# Altium project ValentineMCU.PrjPCB
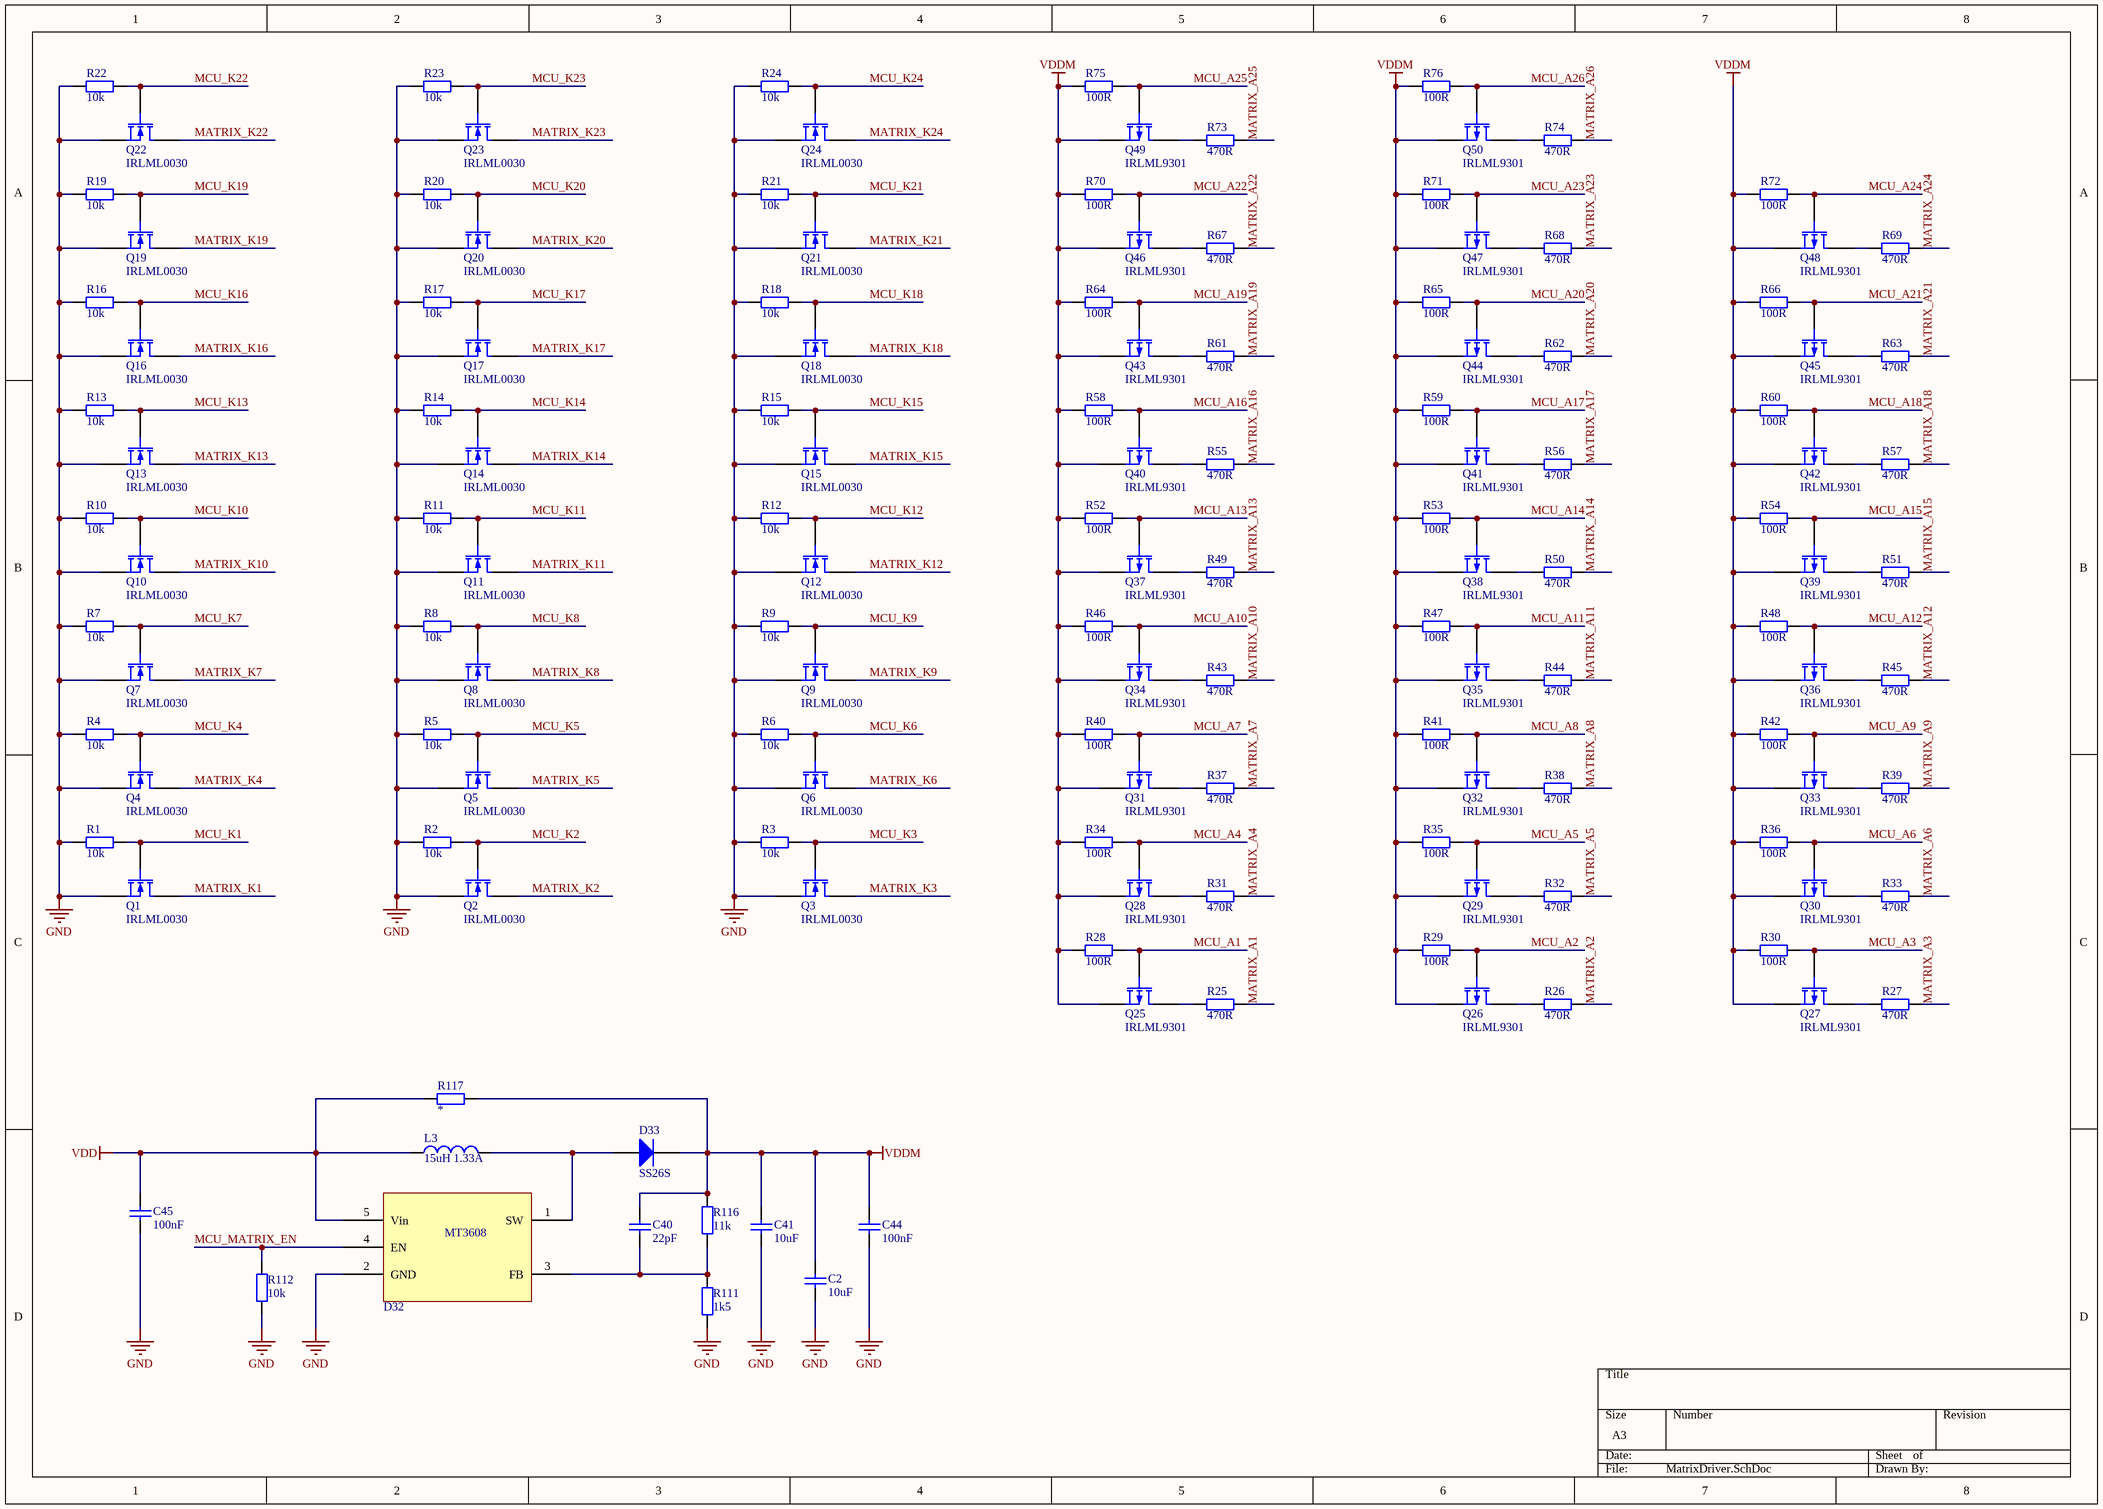
[diagram p0: MatrixDriver.SchDoc]
3 sheets, 262 parts. Net scope: global (net labels, ports and power ports of the same name join across sheets).
Board file: PCB2.PcbDoc
Sheets:
  MatrixDriver.SchDoc
  MCU.SchDoc
  MCULeds.SchDoc

## Sheet MatrixDriver.SchDoc
size A3

### Parts
C2  value 10uF  [c1206]  (hidden comment: Cap)
C40  value 22pF  [C0603]  (hidden comment: Cap)
C41  value 10uF  [c1206]  (hidden comment: Cap)
C44  value 100nF  [C0603]  (hidden comment: Cap)
C45  value 100nF  [C0603]  (hidden comment: Cap)
D32  MT3608  [SOT23-6_L]
D33  SS26S  [DO-214AB]
L3  value 15uH 1.33A  [DE0703]  (hidden comment: DE0703-15)
Q1  IRLML0030  [sot23]
Q2  IRLML0030  [sot23]
Q3  IRLML0030  [sot23]
Q4  IRLML0030  [sot23]
Q5  IRLML0030  [sot23]
Q6  IRLML0030  [sot23]
Q7  IRLML0030  [sot23]
Q8  IRLML0030  [sot23]
Q9  IRLML0030  [sot23]
Q10  IRLML0030  [sot23]
Q11  IRLML0030  [sot23]
Q12  IRLML0030  [sot23]
Q13  IRLML0030  [sot23]
Q14  IRLML0030  [sot23]
Q15  IRLML0030  [sot23]
Q16  IRLML0030  [sot23]
Q17  IRLML0030  [sot23]
Q18  IRLML0030  [sot23]
Q19  IRLML0030  [sot23]
Q20  IRLML0030  [sot23]
Q21  IRLML0030  [sot23]
Q22  IRLML0030  [sot23]
Q23  IRLML0030  [sot23]
Q24  IRLML0030  [sot23]
Q25  IRLML9301  [sot23]
Q26  IRLML9301  [sot23]
Q27  IRLML9301  [sot23]
Q28  IRLML9301  [sot23]
Q29  IRLML9301  [sot23]
Q30  IRLML9301  [sot23]
Q31  IRLML9301  [sot23]
Q32  IRLML9301  [sot23]
Q33  IRLML9301  [sot23]
Q34  IRLML9301  [sot23]
Q35  IRLML9301  [sot23]
Q36  IRLML9301  [sot23]
Q37  IRLML9301  [sot23]
Q38  IRLML9301  [sot23]
Q39  IRLML9301  [sot23]
Q40  IRLML9301  [sot23]
Q41  IRLML9301  [sot23]
Q42  IRLML9301  [sot23]
Q43  IRLML9301  [sot23]
Q44  IRLML9301  [sot23]
Q45  IRLML9301  [sot23]
Q46  IRLML9301  [sot23]
Q47  IRLML9301  [sot23]
Q48  IRLML9301  [sot23]
Q49  IRLML9301  [sot23]
Q50  IRLML9301  [sot23]
R1  value 10k  [r0603]  (hidden comment: Resistor)
R2  value 10k  [r0603]  (hidden comment: Resistor)
R3  value 10k  [r0603]  (hidden comment: Resistor)
R4  value 10k  [r0603]  (hidden comment: Resistor)
R5  value 10k  [r0603]  (hidden comment: Resistor)
R6  value 10k  [r0603]  (hidden comment: Resistor)
R7  value 10k  [r0603]  (hidden comment: Resistor)
R8  value 10k  [r0603]  (hidden comment: Resistor)
R9  value 10k  [r0603]  (hidden comment: Resistor)
R10  value 10k  [r0603]  (hidden comment: Resistor)
R11  value 10k  [r0603]  (hidden comment: Resistor)
R12  value 10k  [r0603]  (hidden comment: Resistor)
R13  value 10k  [r0603]  (hidden comment: Resistor)
R14  value 10k  [r0603]  (hidden comment: Resistor)
R15  value 10k  [r0603]  (hidden comment: Resistor)
R16  value 10k  [r0603]  (hidden comment: Resistor)
R17  value 10k  [r0603]  (hidden comment: Resistor)
R18  value 10k  [r0603]  (hidden comment: Resistor)
R19  value 10k  [r0603]  (hidden comment: Resistor)
R20  value 10k  [r0603]  (hidden comment: Resistor)
R21  value 10k  [r0603]  (hidden comment: Resistor)
R22  value 10k  [r0603]  (hidden comment: Resistor)
R23  value 10k  [r0603]  (hidden comment: Resistor)
R24  value 10k  [r0603]  (hidden comment: Resistor)
R25  value 470R  [r0603]  (hidden comment: Resistor)
R26  value 470R  [r0603]  (hidden comment: Resistor)
R27  value 470R  [r0603]  (hidden comment: Resistor)
R28  value 100R  [r0603]  (hidden comment: Resistor)
R29  value 100R  [r0603]  (hidden comment: Resistor)
R30  value 100R  [r0603]  (hidden comment: Resistor)
R31  value 470R  [r0603]  (hidden comment: Resistor)
R32  value 470R  [r0603]  (hidden comment: Resistor)
R33  value 470R  [r0603]  (hidden comment: Resistor)
R34  value 100R  [r0603]  (hidden comment: Resistor)
R35  value 100R  [r0603]  (hidden comment: Resistor)
R36  value 100R  [r0603]  (hidden comment: Resistor)
R37  value 470R  [r0603]  (hidden comment: Resistor)
R38  value 470R  [r0603]  (hidden comment: Resistor)
R39  value 470R  [r0603]  (hidden comment: Resistor)
R40  value 100R  [r0603]  (hidden comment: Resistor)
R41  value 100R  [r0603]  (hidden comment: Resistor)
R42  value 100R  [r0603]  (hidden comment: Resistor)
R43  value 470R  [r0603]  (hidden comment: Resistor)
R44  value 470R  [r0603]  (hidden comment: Resistor)
R45  value 470R  [r0603]  (hidden comment: Resistor)
R46  value 100R  [r0603]  (hidden comment: Resistor)
R47  value 100R  [r0603]  (hidden comment: Resistor)
R48  value 100R  [r0603]  (hidden comment: Resistor)
R49  value 470R  [r0603]  (hidden comment: Resistor)
R50  value 470R  [r0603]  (hidden comment: Resistor)
R51  value 470R  [r0603]  (hidden comment: Resistor)
R52  value 100R  [r0603]  (hidden comment: Resistor)
R53  value 100R  [r0603]  (hidden comment: Resistor)
R54  value 100R  [r0603]  (hidden comment: Resistor)
R55  value 470R  [r0603]  (hidden comment: Resistor)
R56  value 470R  [r0603]  (hidden comment: Resistor)
R57  value 470R  [r0603]  (hidden comment: Resistor)
R58  value 100R  [r0603]  (hidden comment: Resistor)
R59  value 100R  [r0603]  (hidden comment: Resistor)
R60  value 100R  [r0603]  (hidden comment: Resistor)
R61  value 470R  [r0603]  (hidden comment: Resistor)
R62  value 470R  [r0603]  (hidden comment: Resistor)
R63  value 470R  [r0603]  (hidden comment: Resistor)
R64  value 100R  [r0603]  (hidden comment: Resistor)
R65  value 100R  [r0603]  (hidden comment: Resistor)
R66  value 100R  [r0603]  (hidden comment: Resistor)
R67  value 470R  [r0603]  (hidden comment: Resistor)
R68  value 470R  [r0603]  (hidden comment: Resistor)
R69  value 470R  [r0603]  (hidden comment: Resistor)
R70  value 100R  [r0603]  (hidden comment: Resistor)
R71  value 100R  [r0603]  (hidden comment: Resistor)
R72  value 100R  [r0603]  (hidden comment: Resistor)
R73  value 470R  [r0603]  (hidden comment: Resistor)
R74  value 470R  [r0603]  (hidden comment: Resistor)
R75  value 100R  [r0603]  (hidden comment: Resistor)
R76  value 100R  [r0603]  (hidden comment: Resistor)
R111  value 1k5  [r0603]  (hidden comment: Resistor)
R112  value 10k  [r0603]  (hidden comment: Resistor)
R116  value 11k  [r0603]  (hidden comment: Resistor)
R117  Resistor  [n0603]  (value not drawn)

### Nets
GND: C2.1 C41.1 C44.1 C45.1 D32.2(GND) Q1.2(S) Q2.2(S) Q3.2(S) Q4.2(S) Q5.2(S) Q6.2(S) Q7.2(S) Q8.2(S) Q9.2(S) Q10.2(S) Q11.2(S) Q12.2(S) Q13.2(S) Q14.2(S) Q15.2(S) Q16.2(S) Q17.2(S) Q18.2(S) Q19.2(S) Q20.2(S) Q21.2(S) Q22.2(S) Q23.2(S) Q24.2(S) R1.1 R2.1 R3.1 R4.1 R5.1 R6.1 R7.1 R8.1 R9.1 R10.1 R11.1 R12.1 R13.1 R14.1 R15.1 R16.1 R17.1 R18.1 R19.1 R20.1 R21.1 R22.1 R23.1 R24.1 R111.1 R112.1
VDD: C45.2 D32.5(Vin) L3.1 R117.2
VDDM: C2.2 C40.2 C41.2 C44.2 D33.2(K) Q25.2(S) Q26.2(S) Q27.2(S) Q28.2(S) Q29.2(S) Q30.2(S) Q31.2(S) Q32.2(S) Q33.2(S) Q34.2(S) Q35.2(S) Q36.2(S) Q37.2(S) Q38.2(S) Q39.2(S) Q40.2(S) Q41.2(S) Q42.2(S) Q43.2(S) Q44.2(S) Q45.2(S) Q46.2(S) Q47.2(S) Q48.2(S) Q49.2(S) Q50.2(S) R28.1 R29.1 R30.1 R34.1 R35.1 R36.1 R40.1 R41.1 R42.1 R46.1 R47.1 R48.1 R52.1 R53.1 R54.1 R58.1 R59.1 R60.1 R64.1 R65.1 R66.1 R70.1 R71.1 R72.1 R75.1 R76.1 R116.2 R117.1
MATRIX_A1: R25.2
MATRIX_A2: R26.2
MATRIX_A3: R27.2
MATRIX_A4: R31.2
MATRIX_A5: R32.2
MATRIX_A6: R33.2
MATRIX_A7: R37.2
MATRIX_A8: R38.2
MATRIX_A9: R39.2
MATRIX_A10: R43.2
MATRIX_A11: R44.2
MATRIX_A12: R45.2
MATRIX_A13: R49.2
MATRIX_A14: R50.2
MATRIX_A15: R51.2
MATRIX_A16: R55.2
MATRIX_A17: R56.2
MATRIX_A18: R57.2
MATRIX_A19: R61.2
MATRIX_A20: R62.2
MATRIX_A21: R63.2
MATRIX_A22: R67.2
MATRIX_A23: R68.2
MATRIX_A24: R69.2
MATRIX_A25: R73.2
MATRIX_A26: R74.2
MATRIX_K1: Q1.3(D)
MATRIX_K2: Q2.3(D)
MATRIX_K3: Q3.3(D)
MATRIX_K4: Q4.3(D)
MATRIX_K5: Q5.3(D)
MATRIX_K6: Q6.3(D)
MATRIX_K7: Q7.3(D)
MATRIX_K8: Q8.3(D)
MATRIX_K9: Q9.3(D)
MATRIX_K10: Q10.3(D)
MATRIX_K11: Q11.3(D)
MATRIX_K12: Q12.3(D)
MATRIX_K13: Q13.3(D)
MATRIX_K14: Q14.3(D)
MATRIX_K15: Q15.3(D)
MATRIX_K16: Q16.3(D)
MATRIX_K17: Q17.3(D)
MATRIX_K18: Q18.3(D)
MATRIX_K19: Q19.3(D)
MATRIX_K20: Q20.3(D)
MATRIX_K21: Q21.3(D)
MATRIX_K22: Q22.3(D)
MATRIX_K23: Q23.3(D)
MATRIX_K24: Q24.3(D)
MCU_A1: Q25.1(G) R28.2
MCU_A2: Q26.1(G) R29.2
MCU_A3: Q27.1(G) R30.2
MCU_A4: Q28.1(G) R34.2
MCU_A5: Q29.1(G) R35.2
MCU_A6: Q30.1(G) R36.2
MCU_A7: Q31.1(G) R40.2
MCU_A8: Q32.1(G) R41.2
MCU_A9: Q33.1(G) R42.2
MCU_A10: Q34.1(G) R46.2
MCU_A11: Q35.1(G) R47.2
MCU_A12: Q36.1(G) R48.2
MCU_A13: Q37.1(G) R52.2
MCU_A14: Q38.1(G) R53.2
MCU_A15: Q39.1(G) R54.2
MCU_A16: Q40.1(G) R58.2
MCU_A17: Q41.1(G) R59.2
MCU_A18: Q42.1(G) R60.2
MCU_A19: Q43.1(G) R64.2
MCU_A20: Q44.1(G) R65.2
MCU_A21: Q45.1(G) R66.2
MCU_A22: Q46.1(G) R70.2
MCU_A23: Q47.1(G) R71.2
MCU_A24: Q48.1(G) R72.2
MCU_A25: Q49.1(G) R75.2
MCU_A26: Q50.1(G) R76.2
MCU_K1: Q1.1(G) R1.2
MCU_K2: Q2.1(G) R2.2
MCU_K3: Q3.1(G) R3.2
MCU_K4: Q4.1(G) R4.2
MCU_K5: Q5.1(G) R5.2
MCU_K6: Q6.1(G) R6.2
MCU_K7: Q7.1(G) R7.2
MCU_K8: Q8.1(G) R8.2
MCU_K9: Q9.1(G) R9.2
MCU_K10: Q10.1(G) R10.2
MCU_K11: Q11.1(G) R11.2
MCU_K12: Q12.1(G) R12.2
MCU_K13: Q13.1(G) R13.2
MCU_K14: Q14.1(G) R14.2
MCU_K15: Q15.1(G) R15.2
MCU_K16: Q16.1(G) R16.2
MCU_K17: Q17.1(G) R17.2
MCU_K18: Q18.1(G) R18.2
MCU_K19: Q19.1(G) R19.2
MCU_K20: Q20.1(G) R20.2
MCU_K21: Q21.1(G) R21.2
MCU_K22: Q22.1(G) R22.2
MCU_K23: Q23.1(G) R23.2
MCU_K24: Q24.1(G) R24.2
MCU_MATRIX_EN: D32.4(EN) R112.2
NetC40_1: C40.1 D32.3(FB) R111.2 R116.1
NetD32_1: D32.1(SW) D33.1(A) L3.2
NetQ25_3: Q25.3(D) R25.1
NetQ26_3: Q26.3(D) R26.1
NetQ27_3: Q27.3(D) R27.1
NetQ28_3: Q28.3(D) R31.1
NetQ29_3: Q29.3(D) R32.1
NetQ30_3: Q30.3(D) R33.1
NetQ31_3: Q31.3(D) R37.1
NetQ32_3: Q32.3(D) R38.1
NetQ33_3: Q33.3(D) R39.1
NetQ34_3: Q34.3(D) R43.1
NetQ35_3: Q35.3(D) R44.1
NetQ36_3: Q36.3(D) R45.1
NetQ37_3: Q37.3(D) R49.1
NetQ38_3: Q38.3(D) R50.1
NetQ39_3: Q39.3(D) R51.1
NetQ40_3: Q40.3(D) R55.1
NetQ41_3: Q41.3(D) R56.1
NetQ42_3: Q42.3(D) R57.1
NetQ43_3: Q43.3(D) R61.1
NetQ44_3: Q44.3(D) R62.1
NetQ45_3: Q45.3(D) R63.1
NetQ46_3: Q46.3(D) R67.1
NetQ47_3: Q47.3(D) R68.1
NetQ48_3: Q48.3(D) R69.1
NetQ49_3: Q49.3(D) R73.1
NetQ50_3: Q50.3(D) R74.1

### Library data of the parts
C2 C40 C41 C44 C45 = Cap: Capacitor; Published: 8-Jun-2000; LatestRevisionDate: 17-Jul-2002; LatestRevisionNote: Re-released for DXP Platform.; PackageReference: RAD-0.3; Publisher: Altium Limited; PackageDescription: Radial Cap, Thru-Hole; 2 Leads; 0.3 in Pin Spacing
D33 = Diode: Default Diode; Published: 8-Jun-2000; LatestRevisionDate: 17-Jul-2002; LatestRevisionNote: Re-released for DXP Platform.; PackageVersion: Sep-1996; PackageReference: SMC; Publisher: Altium Limited; PackageDescription: DO-214-AB/SMC; 2 C-Bend Leads; Body 7.9 x 5.9 mm, inc. leads (LxW); Code_JEDEC: DO-214-AB
L3 = Inductor: Code_IEC: 1005; Published: 8-Jun-2000; LatestRevisionDate: 29-May-2009; LatestRevisionNote: IPC-7351 Footprint Added.; PackageReference: 0402-A; Publisher: Altium Limited; PackageDescription: Chip Inductor; Code_JEITA: 0402
Q1-Q24 = MOSFET-N: N-Channel MOSFET; Published: 8-Jun-2000; LatestRevisionDate: 17-Jul-2002; LatestRevisionNote: Re-released for DXP Platform.; PackageVersion: 1995/1996; PackageReference: E3; Publisher: Altium Limited; PackageDescription: TO, Flat Index; 3 In-Line, Axial Leads; Body Dia. 4.6mm; Lead Dia. 0.5 mm (max)
Q25-Q50 = MOSFET-P: P-Channel MOSFET; Published: 8-Jun-2000; LatestRevisionDate: 17-Jul-2002; LatestRevisionNote: Re-released for DXP Platform.; PackageVersion: 1995/1996; PackageReference: E3; Publisher: Altium Limited; PackageDescription: TO, Flat Index; 3 In-Line, Axial Leads; Body Dia. 4.6mm; Lead Dia. 0.5 mm (max)
R1-R76 R111 R112 R116 R117 = Resistor: Published: 8-Jun-2000; LatestRevisionDate: 17-Jul-2002; LatestRevisionNote: Re-released for DXP Platform.; PackageReference: AXIAL-0.4; Publisher: Altium Limited; PackageDescription: Axial Device, Thru-Hole; 2 Leads; 0.4 in Pin Spacing
  R117: Value: *

## Sheet MCU.SchDoc
size A3
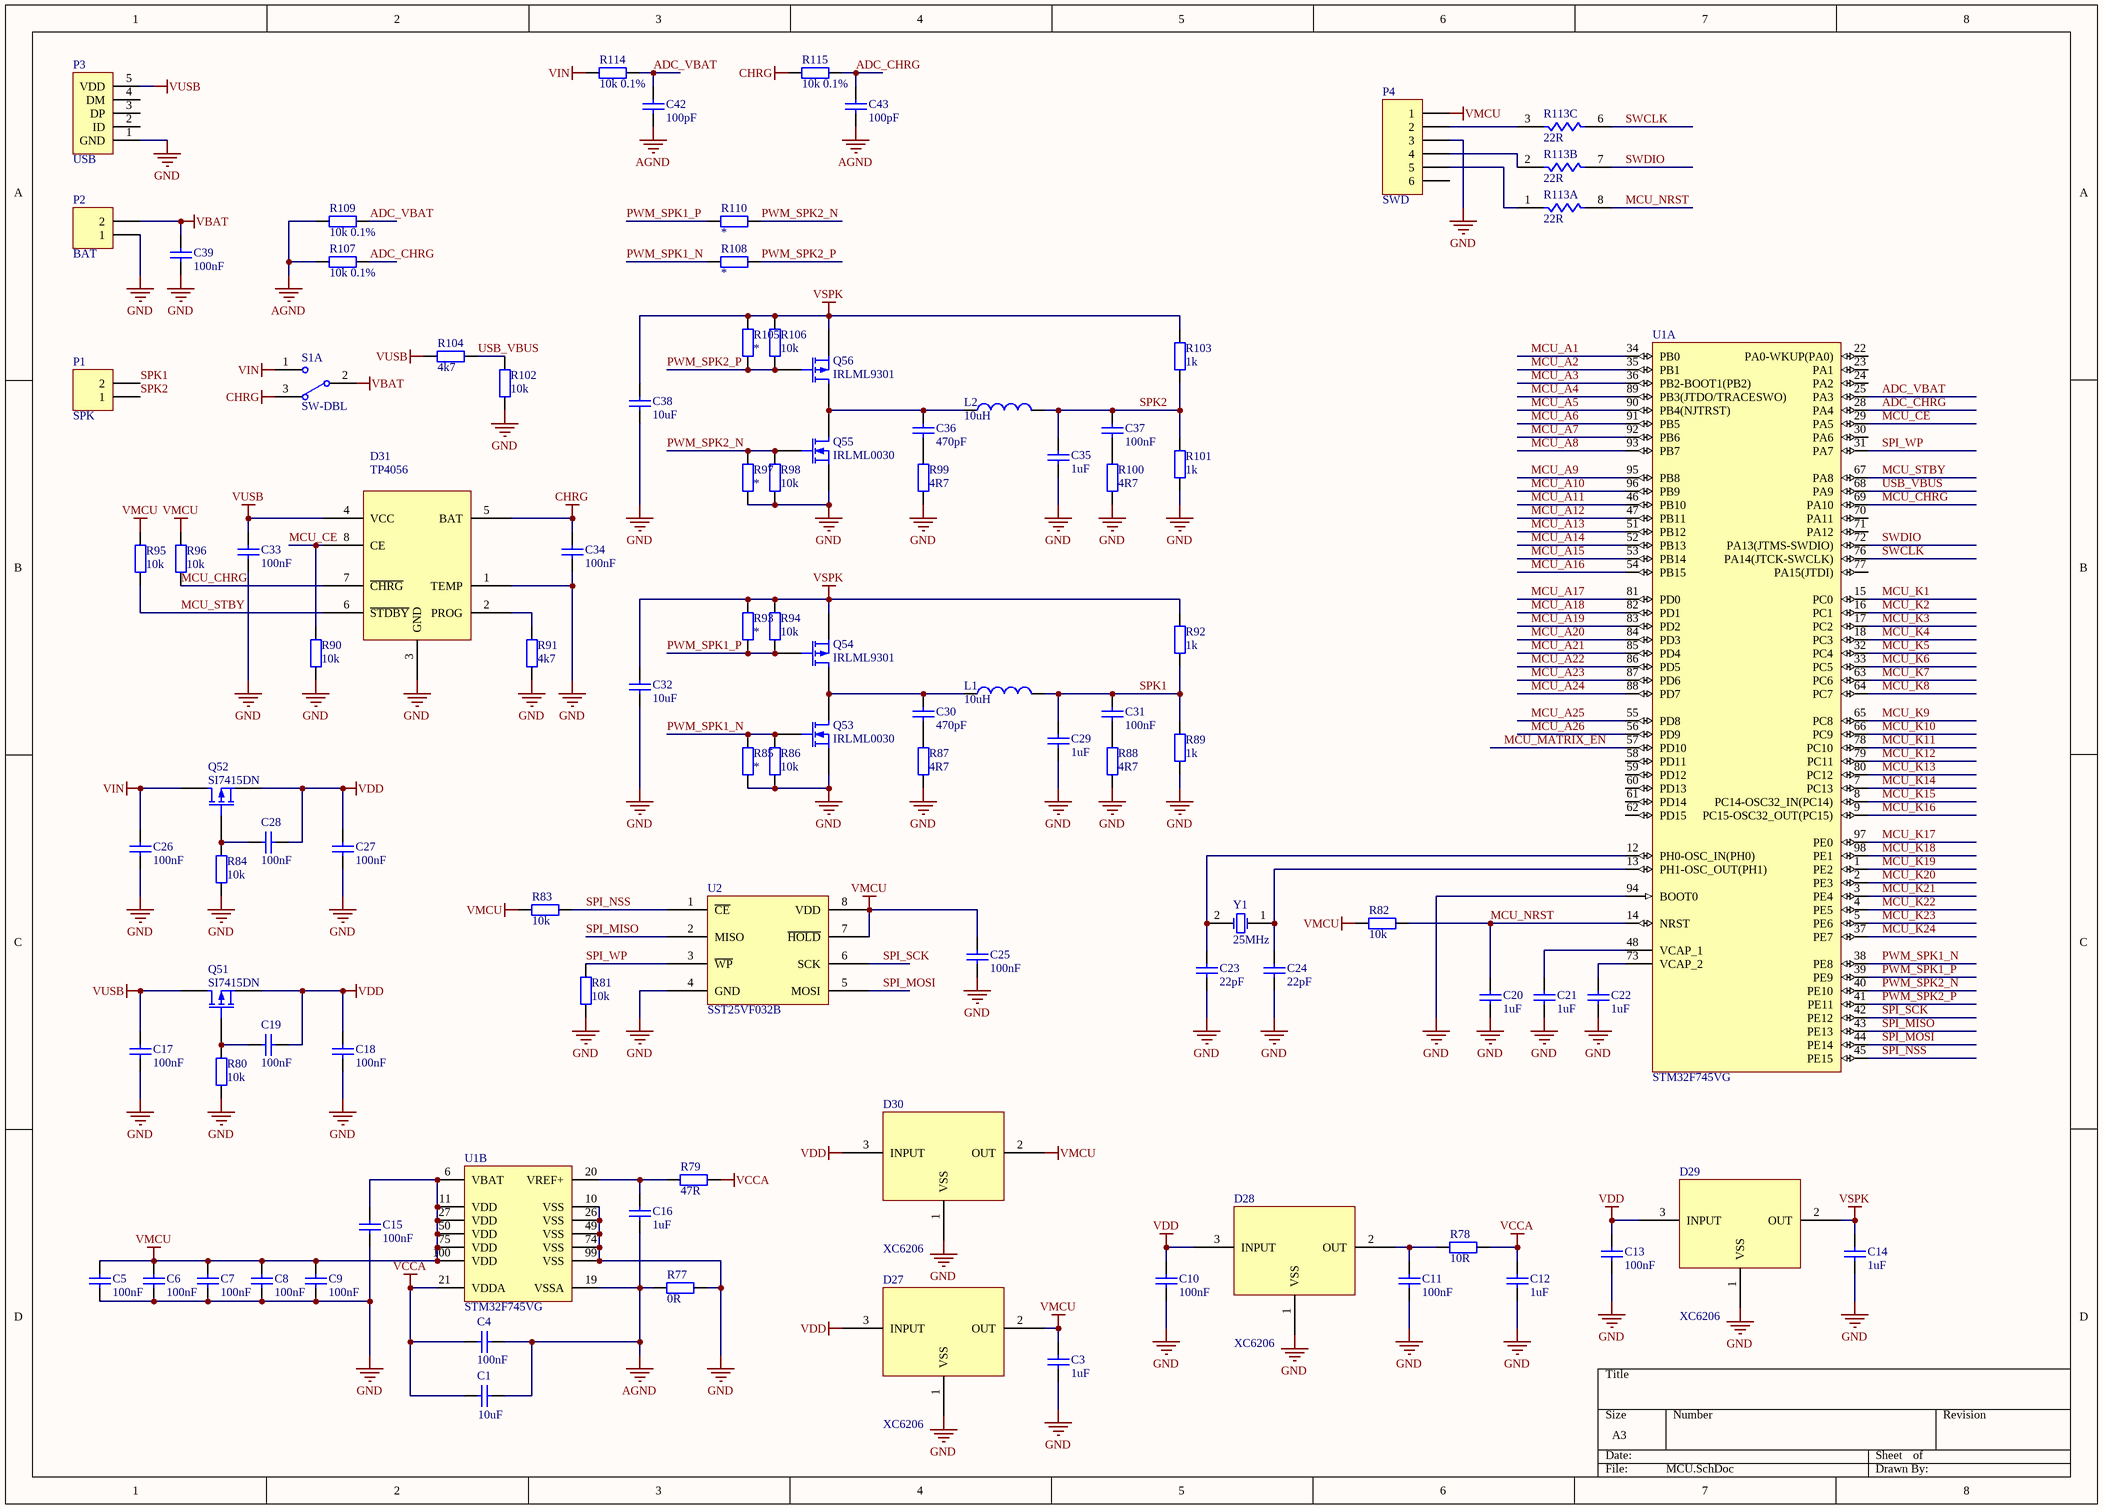
[diagram p1: MCU.SchDoc]

### Parts
C1  value 10uF  [c1206]  (hidden comment: Cap)
C3  value 1uF  [C0603]  (hidden comment: Cap)
C4  value 100nF  [C0603]  (hidden comment: Cap)
C5  value 100nF  [C0603]  (hidden comment: Cap)
C6  value 100nF  [C0603]  (hidden comment: Cap)
C7  value 100nF  [C0603]  (hidden comment: Cap)
C8  value 100nF  [C0603]  (hidden comment: Cap)
C9  value 100nF  [C0603]  (hidden comment: Cap)
C10  value 100nF  [C0603]  (hidden comment: Cap)
C11  value 100nF  [C0603]  (hidden comment: Cap)
C12  value 1uF  [C0603]  (hidden comment: Cap)
C13  value 100nF  [C0603]  (hidden comment: Cap)
C14  value 1uF  [C0603]  (hidden comment: Cap)
C15  value 100nF  [C0603]  (hidden comment: Cap)
C16  value 1uF  [C0603]  (hidden comment: Cap)
C17  value 100nF  [C0603]  (hidden comment: Cap)
C18  value 100nF  [C0603]  (hidden comment: Cap)
C19  value 100nF  [C0603]  (hidden comment: Cap)
C20  value 1uF  [C0603]  (hidden comment: Cap)
C21  value 1uF  [C0603]  (hidden comment: Cap)
C22  value 1uF  [C0603]  (hidden comment: Cap)
C23  value 22pF  [c0603]
C24  value 22pF  [c0603]
C25  value 100nF  [C0603]  (hidden comment: Cap)
C26  value 100nF  [C0603]  (hidden comment: Cap)
C27  value 100nF  [C0603]  (hidden comment: Cap)
C28  value 100nF  [C0603]  (hidden comment: Cap)
C29  value 1uF  [C0603]  (hidden comment: Cap)
C30  value 470pF  [C0603]  (hidden comment: Cap)
C31  value 100nF  [C0603]  (hidden comment: Cap)
C32  value 10uF  [c1206]  (hidden comment: Cap)
C33  value 100nF  [C0603]  (hidden comment: Cap)
C34  value 100nF  [C0603]  (hidden comment: Cap)
C35  value 1uF  [C0603]  (hidden comment: Cap)
C36  value 470pF  [C0603]  (hidden comment: Cap)
C37  value 100nF  [C0603]  (hidden comment: Cap)
C38  value 10uF  [c1206]  (hidden comment: Cap)
C39  value 100nF  [C0603]  (hidden comment: Cap)
C42  value 100pF  [C0603]  (hidden comment: Cap)
C43  value 100pF  [C0603]  (hidden comment: Cap)
D27  XC6206  [sot23]
D28  XC6206  [sot23]
D29  XC6206  [sot23]
D30  XC6206  [sot23]
D31  TP4056  [SO8_WPAD]
L1  value 10uH  [CD32_Inductor]
L2  value 10uH  [CD32_Inductor]
P1  SPK  [HDR1X2]
P2  BAT  [HDR1X2]
P3  USB  [MICRO_USB]
P4  SWD  [HDR1X6]
Q51  SI7415DN  [PowerPAK1212-8]
Q52  SI7415DN  [PowerPAK1212-8]
Q53  IRLML0030  [sot23]
Q54  IRLML9301  [sot23]
Q55  IRLML0030  [sot23]
Q56  IRLML9301  [sot23]
R77  value 0R  [r0603]  (hidden comment: Resistor)
R78  value 10R  [r0603]  (hidden comment: Resistor)
R79  value 47R  [r0603]  (hidden comment: Resistor)
R80  value 10k  [r0603]  (hidden comment: Resistor)
R81  value 10k  [r0603]  (hidden comment: Resistor)
R82  value 10k  [r0603]  (hidden comment: Resistor)
R83  value 10k  [r0603]  (hidden comment: Resistor)
R84  value 10k  [r0603]  (hidden comment: Resistor)
R85  Resistor  [n0603]  (value not drawn)
R86  value 10k  [r0603]  (hidden comment: Resistor)
R87  value 4R7  [r0603]  (hidden comment: Resistor)
R88  value 4R7  [r0603]  (hidden comment: Resistor)
R89  value 1k  [r0603]  (hidden comment: Resistor)
R90  value 10k  [r0603]  (hidden comment: Resistor)
R91  value 4k7  [r0603]  (hidden comment: Resistor)
R92  value 1k  [r0603]  (hidden comment: Resistor)
R93  Resistor  [n0603]  (value not drawn)
R94  value 10k  [r0603]  (hidden comment: Resistor)
R95  value 10k  [r0603]  (hidden comment: Resistor)
R96  value 10k  [r0603]  (hidden comment: Resistor)
R97  Resistor  [n0603]  (value not drawn)
R98  value 10k  [r0603]  (hidden comment: Resistor)
R99  value 4R7  [r0603]  (hidden comment: Resistor)
R100  value 4R7  [r0603]  (hidden comment: Resistor)
R101  value 1k  [r0603]  (hidden comment: Resistor)
R102  value 10k  [r0603]  (hidden comment: Resistor)
R103  value 1k  [r0603]  (hidden comment: Resistor)
R104  value 4k7  [r0603]  (hidden comment: Resistor)
R105  Resistor  [n0603]  (value not drawn)
R106  value 10k  [r0603]  (hidden comment: Resistor)
R107  value 10k 0.1%  [r0603]  (hidden comment: Resistor)
R108  Resistor  [n0603]  (value not drawn)
R109  value 10k 0.1%  [r0603]  (hidden comment: Resistor)
R110  Resistor  [n0603]  (value not drawn)
R113  value 22R  [R1206_PACK]  (hidden comment: Res Pack 1206)  (parts A,B,C of 4)
R114  value 10k 0.1%  [r0603]  (hidden comment: Resistor)
R115  value 10k 0.1%  [r0603]  (hidden comment: Resistor)
S1  SW-DBL  [SK-22D07VG5]  (part A of 2)
U1  STM32F745VG  [lqfp100_m]  (parts A,B of 2)
U2  SST25VF032B  [SO8_25EE]
Y1  25MHz  [KX-7]

### Nets
AGND: C1.2 C4.2 C16.1 C42.1 C43.1 R77.1 R107.2 R109.2 U1.19(VSSA)
CHRG: C34.2 D31.5(BAT) R115.2 S1.3
GND: C3.1 C5.1 C6.1 C7.1 C8.1 C9.1 C10.1 C11.1 C12.1 C13.1 C14.1 C15.1 C17.1 C18.1 C20.1 C21.1 C22.1 C23.2 C24.2 C25.1 C26.1 C27.1 C29.1 C32.1 C33.1 C34.1 C35.1 C38.1 C39.1 D27.1(VSS) D28.1(VSS) D29.1(VSS) D30.1(VSS) D31.1(TEMP) D31.3(GND) P2.1 P3.1(GND) P4.3 Q53.2(S) Q55.2(S) R77.2 R80.1 R81.1 R84.1 R85.1 R86.1 R87.1 R88.1 R89.1 R90.1 R91.1 R97.1 R98.1 R99.1 R100.1 R101.1 R102.2 U1.10(VSS) U1.26(VSS) U1.49(VSS) U1.74(VSS) U1.94(BOOT0) U1.99(VSS) U2.4(GND)
VBAT: C39.2 P2.2 S1.2
VCCA: C1.1 C4.1 C12.2 R78.2 R79.2 U1.21(VDDA)
VDD: C10.2 C13.2 C18.2 C19.1 C27.2 C28.1 D27.3(INPUT) D28.3(INPUT) D29.3(INPUT) D30.3(INPUT) Q51.2(S) Q52.2(S)
VIN: C26.2 Q52.3(D) R114.2 S1.1
VMCU: C3.2 C5.2 C6.2 C7.2 C8.2 C9.2 C15.2 C25.2 D27.2(OUT) D30.2(OUT) P4.1 R82.1 R83.1 R95.2 R96.2 U1.6(VBAT) U1.11(VDD) U1.27(VDD) U1.50(VDD) U1.75(VDD) U1.100(VDD) U2.7(~{HOLD}) U2.8(VDD)
VSPK: C14.2 C32.2 C38.2 D29.2(OUT) Q54.2(S) Q56.2(S) R92.2 R93.2 R94.2 R103.2 R105.2 R106.2
VUSB: C17.2 C33.2 D31.4(VCC) P3.5(VDD) Q51.3(D) R104.2
ADC_CHRG: C43.2 R107.1 R115.1 U1.28(PA4)
ADC_VBAT: C42.2 R109.1 R114.1 U1.25(PA3)
MCU_A1: U1.34(PB0)
MCU_A2: U1.35(PB1)
MCU_A3: U1.36(PB2-BOOT1(PB2))
MCU_A4: U1.89(PB3(JTDO/TRACESWO))
MCU_A5: U1.90(PB4(NJTRST))
MCU_A6: U1.91(PB5)
MCU_A7: U1.92(PB6)
MCU_A8: U1.93(PB7)
MCU_A9: U1.95(PB8)
MCU_A10: U1.96(PB9)
MCU_A11: U1.46(PB10)
MCU_A12: U1.47(PB11)
MCU_A13: U1.51(PB12)
MCU_A14: U1.52(PB13)
MCU_A15: U1.53(PB14)
MCU_A16: U1.54(PB15)
MCU_A17: U1.81(PD0)
MCU_A18: U1.82(PD1)
MCU_A19: U1.83(PD2)
MCU_A20: U1.84(PD3)
MCU_A21: U1.85(PD4)
MCU_A22: U1.86(PD5)
MCU_A23: U1.87(PD6)
MCU_A24: U1.88(PD7)
MCU_A25: U1.55(PD8)
MCU_A26: U1.56(PD9)
MCU_CE: D31.8(CE) R90.2 U1.29(PA5)
MCU_CHRG: D31.7(~{CHRG}) R96.1 U1.69(PA10)
MCU_K1: U1.15(PC0)
MCU_K2: U1.16(PC1)
MCU_K3: U1.17(PC2)
MCU_K4: U1.18(PC3)
MCU_K5: U1.32(PC4)
MCU_K6: U1.33(PC5)
MCU_K7: U1.63(PC6)
MCU_K8: U1.64(PC7)
MCU_K9: U1.65(PC8)
MCU_K10: U1.66(PC9)
MCU_K11: U1.78(PC10)
MCU_K12: U1.79(PC11)
MCU_K13: U1.80(PC12)
MCU_K14: U1.7(PC13)
MCU_K15: U1.8(PC14-OSC32_IN(PC14))
MCU_K16: U1.9(PC15-OSC32_OUT(PC15))
MCU_K17: U1.97(PE0)
MCU_K18: U1.98(PE1)
MCU_K19: U1.1(PE2)
MCU_K20: U1.2(PE3)
MCU_K21: U1.3(PE4)
MCU_K22: U1.4(PE5)
MCU_K23: U1.5(PE6)
MCU_K24: U1.37(PE7)
MCU_MATRIX_EN: U1.57(PD10)
MCU_NRST: C20.2 R82.2 R113.8 U1.14(NRST)
MCU_STBY: D31.6(~{STDBY}) R95.1 U1.67(PA8)
PWM_SPK1_N: Q53.1(G) R85.2 R86.2 R108.2 U1.38(PE8)
PWM_SPK1_P: Q54.1(G) R93.1 R94.1 R110.2 U1.39(PE9)
PWM_SPK2_N: Q55.1(G) R97.2 R98.2 R110.1 U1.40(PE10)
PWM_SPK2_P: Q56.1(G) R105.1 R106.1 R108.1 U1.41(PE11)
SPI_MISO: U1.43(PE13) U2.2(MISO)
SPI_MOSI: U1.44(PE14) U2.5(MOSI)
SPI_NSS: R83.2 U1.45(PE15) U2.1(~{CE})
SPI_SCK: U1.42(PE12) U2.6(SCK)
SPI_WP: R81.2 U1.31(PA7) U2.3(~{WP})
SPK1: C29.2 C31.2 L1.2 P1.2 R89.2 R92.1
SPK2: C35.2 C37.2 L2.2 P1.1 R101.2 R103.1
SWCLK: R113.6 U1.76(PA14(JTCK-SWCLK))
SWDIO: R113.7 U1.72(PA13(JTMS-SWDIO))
USB_VBUS: R102.1 R104.1 U1.68(PA9)
NetC11_2: C11.2 D28.2(OUT) R78.1
NetC16_2: C16.2 R79.1 U1.20(VREF+)
NetC19_2: C19.2 Q51.1(G) R80.2
NetC21_2: C21.2 U1.48(VCAP_1)
NetC22_2: C22.2 U1.73(VCAP_2)
NetC23_1: C23.1 U1.12(PH0-OSC_IN(PH0)) Y1.2(OSC2)
NetC24_1: C24.1 U1.13(PH1-OSC_OUT(PH1)) Y1.1(OSC1)
NetC28_2: C28.2 Q52.1(G) R84.2
NetC30_1: C30.1 R87.2
NetC30_2: C30.2 L1.1 Q53.3(D) Q54.3(D)
NetC31_1: C31.1 R88.2
NetC36_1: C36.1 R99.2
NetC36_2: C36.2 L2.1 Q55.3(D) Q56.3(D)
NetC37_1: C37.1 R100.2
NetD31_2: D31.2(PROG) R91.2
NetP4_2: P4.2 R113.3
NetP4_4: P4.4 R113.2
NetP4_5: P4.5 R113.1

Not connected (* = marked no-connect by the designer): P3 2(ID) 3(DP) 4(DM); P4 6; U1 22(PA0-WKUP(PA0)) 23(PA1) 24(PA2) 30(PA6) 58(PD11) 59(PD12) 60(PD13) 61(PD14) 62(PD15) 70(PA11) 71(PA12) 77(PA15(JTDI))

### Library data of the parts
C1 C3-C39 C42 C43 = Cap: Capacitor; Published: 8-Jun-2000; LatestRevisionDate: 17-Jul-2002; LatestRevisionNote: Re-released for DXP Platform.; PackageReference: RAD-0.3; Publisher: Altium Limited; PackageDescription: Radial Cap, Thru-Hole; 2 Leads; 0.3 in Pin Spacing
L1 L2 = Inductor: Code_IEC: 1005; Published: 8-Jun-2000; LatestRevisionDate: 29-May-2009; LatestRevisionNote: IPC-7351 Footprint Added.; PackageReference: 0402-A; Publisher: Altium Limited; PackageDescription: Chip Inductor; Code_JEITA: 0402
P1 P2 = Header 2: Header, 2-Pin; LatestRevisionDate: 17-Jul-2002; LatestRevisionNote: Re-released for DXP Platform.; Publisher: Altium Limited
P3 = USB: Header, 5-Pin; LatestRevisionDate: 17-Jul-2002; LatestRevisionNote: Re-released for DXP Platform.; Publisher: Altium Limited
P4 = Header 6: Header, 6-Pin; LatestRevisionDate: 17-Jul-2002; LatestRevisionNote: Re-released for DXP Platform.; Publisher: Altium Limited
Q51 Q52 Q54 Q56 = MOSFET-P: P-Channel MOSFET; Published: 8-Jun-2000; LatestRevisionDate: 17-Jul-2002; LatestRevisionNote: Re-released for DXP Platform.; PackageVersion: 1995/1996; PackageReference: E3; Publisher: Altium Limited; PackageDescription: TO, Flat Index; 3 In-Line, Axial Leads; Body Dia. 4.6mm; Lead Dia. 0.5 mm (max)
Q53 Q55 = MOSFET-N: N-Channel MOSFET; Published: 8-Jun-2000; LatestRevisionDate: 17-Jul-2002; LatestRevisionNote: Re-released for DXP Platform.; PackageVersion: 1995/1996; PackageReference: E3; Publisher: Altium Limited; PackageDescription: TO, Flat Index; 3 In-Line, Axial Leads; Body Dia. 4.6mm; Lead Dia. 0.5 mm (max)
R113 = Res Pack 1206: Isolated Resistor Network - Parts; Sim Note: Enter the Resistance value into parameter field.; Published: 24-Mar-1999; LatestRevisionDate: 29-May-2009; LatestRevisionNote: IPC-7351 Footprint Added.; PackageReference: SOIC16; Publisher: Altium Limited; PackageDescription: 16-Pin Small Outline Integrated Circuit 1.27 mm Pitch; Code_JEDEC: MS-012-AC; Code_IPC: SOIC127P600-16
S1 = SW-DBL: SPDT Subminiature Toggle Switch, Right Angle Mounting, Vertical Actuation; Published: 24-Mar-1999; LatestRevisionDate: 17-Dec-2003; LatestRevisionNote: Schematic revised, PCB Footprint replaced.; DatasheetVersion: 05-Dec-2000; PackageReference: TL36WW15050; Publisher: Altium Limited; PackageDescription: Switch; 4 Leads; ComponentLink1Description: Manufacturer Link; ComponentLink1URL: http://www.apem.com
U1 = STM32F746VG: ARM Cortex-M4 32-bit MCU+FPU, 210 DMIPS, 1024 kB Flash, 192 kB Internal RAM, 82 I/Os, 100-pin LQFP, -40 to 85 degC, Tray; Manufacturer: STMicroelectronics; PartNumber: STM32F407VGT6; D/A Converter: 2x12-bit; FLASH Size (Prog) (kB): 1024; I/Os (High Current): 82; Internal RAM Size (kB): 192; Operating Frequency(F) (Processor speed) (MHz): 168; Supply Voltage(Vcc) max (V): 3.6; Supply Voltage(Vcc) min (V): 1.8; DatasheetVersion: Rev. 4; PackageVersion: Rev. 1, 06/2013; PackageReference: LQFP100; PackageDescription: 100-Pin Low Profile Quad Flat Package, 14 x 14 mm Body, 0.5 mm Pitch; Supplier 1: Digi-Key; Supplier Part Number 1: 497-11605-ND; Supplier 2: Farnell; Supplier Part Number 2: 2064368; Supplier 3: Newark; Supplier Part Number 3: 73T2333; Supplier 4: Mouser; Supplier Part Number 4: 511-STM32F407VGT6; Core: ARM Cortex-M4; Packing: Tray; Mounting Technology: Surface Mount; ComponentLink1Description: Manufacturer URL; ComponentLink1URL: http://www.st.com/web/en/home.html; ComponentLink2Description: Datasheet; ComponentLink2URL: http://www.st.com/st-web-ui/static/active/en/resource/technical/document/datasheet/DM00037051.pdf; ComponentLink3Description: Package Specification; ComponentLink3URL: http://www.st.com/st-web-ui/static/active/en/resource/technical/document/data_brief/DM00071938.pdf
U2 = EEPROM_SPI
Y1 = XTAL_4pin: Crystal Oscillator; Published: 8-Jun-2000; LatestRevisionDate: 17-Jul-2002; LatestRevisionNote: Re-released for DXP Platform.; PackageReference: R38; Publisher: Altium Limited; PackageDescription: Crystal, Thru-Hole; 2 Leads; Body 3.1 x 8.2 mm (Dia.xH)
R77-R110 R114 R115 = Resistor: Published: 8-Jun-2000; LatestRevisionDate: 17-Jul-2002; LatestRevisionNote: Re-released for DXP Platform.; PackageReference: AXIAL-0.4; Publisher: Altium Limited; PackageDescription: Axial Device, Thru-Hole; 2 Leads; 0.4 in Pin Spacing
  R85 R93 R97 R105 R108 R110: Value: *

## Sheet MCULeds.SchDoc
size A4
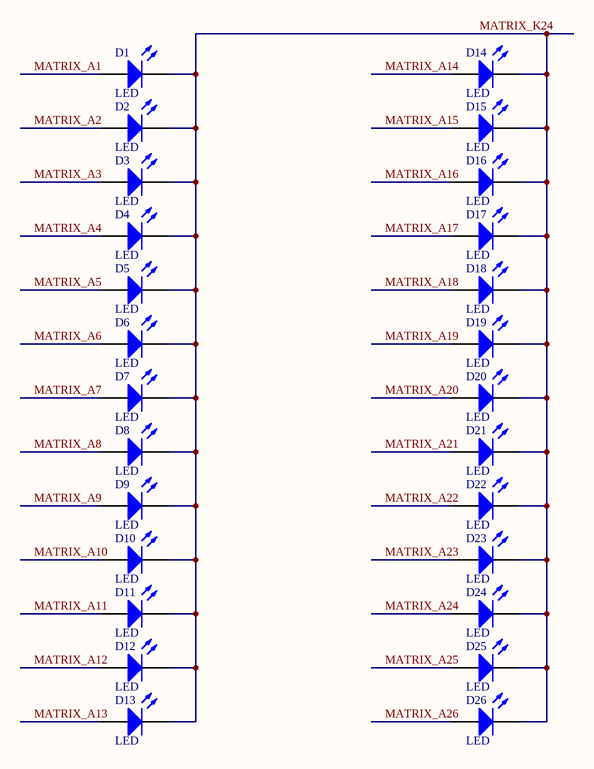
[diagram p2: MCULeds.SchDoc]

### Parts
D1  LED  [led_0402]
D2  LED  [led_0402]
D3  LED  [led_0402]
D4  LED  [led_0402]
D5  LED  [led_0402]
D6  LED  [led_0402]
D7  LED  [led_0402]
D8  LED  [led_0402]
D9  LED  [led_0402]
D10  LED  [led_0402]
D11  LED  [led_0402]
D12  LED  [led_0402]
D13  LED  [led_0402]
D14  LED  [led_0402]
D15  LED  [led_0402]
D16  LED  [led_0402]
D17  LED  [led_0402]
D18  LED  [led_0402]
D19  LED  [led_0402]
D20  LED  [led_0402]
D21  LED  [led_0402]
D22  LED  [led_0402]
D23  LED  [led_0402]
D24  LED  [led_0402]
D25  LED  [led_0402]
D26  LED  [led_0402]

### Nets
MATRIX_A1: D1.A
MATRIX_A2: D2.A
MATRIX_A3: D3.A
MATRIX_A4: D4.A
MATRIX_A5: D5.A
MATRIX_A6: D6.A
MATRIX_A7: D7.A
MATRIX_A8: D8.A
MATRIX_A9: D9.A
MATRIX_A10: D10.A
MATRIX_A11: D11.A
MATRIX_A12: D12.A
MATRIX_A13: D13.A
MATRIX_A14: D14.A
MATRIX_A15: D15.A
MATRIX_A16: D16.A
MATRIX_A17: D17.A
MATRIX_A18: D18.A
MATRIX_A19: D19.A
MATRIX_A20: D20.A
MATRIX_A21: D21.A
MATRIX_A22: D22.A
MATRIX_A23: D23.A
MATRIX_A24: D24.A
MATRIX_A25: D25.A
MATRIX_A26: D26.A
MATRIX_K24: D1.K D2.K D3.K D4.K D5.K D6.K D7.K D8.K D9.K D10.K D11.K D12.K D13.K D14.K D15.K D16.K D17.K D18.K D19.K D20.K D21.K D22.K D23.K D24.K D25.K D26.K

### Library data of the parts
D1-D26 = LED: Typical INFRARED GaAs LED; Published: 8-Jun-2000; LatestRevisionDate: 08-Jul-2005; LatestRevisionNote: Mech Layer 1 removed.; PackageReference: LED-0; Publisher: Altium Limited; PackageDescription: LED; 2 Leads

## Nets that join several sheets
GND: MatrixDriver (55 pins), MCU (64 pins)
VDD: MatrixDriver (C45.2 D32.5 L3.1 R117.2), MCU (12 pins)
MATRIX_A1: MatrixDriver (R25.2), MCULeds (D1.A)
MATRIX_A2: MatrixDriver (R26.2), MCULeds (D2.A)
MATRIX_A3: MatrixDriver (R27.2), MCULeds (D3.A)
MATRIX_A4: MatrixDriver (R31.2), MCULeds (D4.A)
MATRIX_A5: MatrixDriver (R32.2), MCULeds (D5.A)
MATRIX_A6: MatrixDriver (R33.2), MCULeds (D6.A)
MATRIX_A7: MatrixDriver (R37.2), MCULeds (D7.A)
MATRIX_A8: MatrixDriver (R38.2), MCULeds (D8.A)
MATRIX_A9: MatrixDriver (R39.2), MCULeds (D9.A)
MATRIX_A10: MatrixDriver (R43.2), MCULeds (D10.A)
MATRIX_A11: MatrixDriver (R44.2), MCULeds (D11.A)
MATRIX_A12: MatrixDriver (R45.2), MCULeds (D12.A)
MATRIX_A13: MatrixDriver (R49.2), MCULeds (D13.A)
MATRIX_A14: MatrixDriver (R50.2), MCULeds (D14.A)
MATRIX_A15: MatrixDriver (R51.2), MCULeds (D15.A)
MATRIX_A16: MatrixDriver (R55.2), MCULeds (D16.A)
MATRIX_A17: MatrixDriver (R56.2), MCULeds (D17.A)
MATRIX_A18: MatrixDriver (R57.2), MCULeds (D18.A)
MATRIX_A19: MatrixDriver (R61.2), MCULeds (D19.A)
MATRIX_A20: MatrixDriver (R62.2), MCULeds (D20.A)
MATRIX_A21: MatrixDriver (R63.2), MCULeds (D21.A)
MATRIX_A22: MatrixDriver (R67.2), MCULeds (D22.A)
MATRIX_A23: MatrixDriver (R68.2), MCULeds (D23.A)
MATRIX_A24: MatrixDriver (R69.2), MCULeds (D24.A)
MATRIX_A25: MatrixDriver (R73.2), MCULeds (D25.A)
MATRIX_A26: MatrixDriver (R74.2), MCULeds (D26.A)
MATRIX_K24: MatrixDriver (Q24.3), MCULeds (26 pins)
MCU_A1: MatrixDriver (Q25.1 R28.2), MCU (U1.34)
MCU_A2: MatrixDriver (Q26.1 R29.2), MCU (U1.35)
MCU_A3: MatrixDriver (Q27.1 R30.2), MCU (U1.36)
MCU_A4: MatrixDriver (Q28.1 R34.2), MCU (U1.89)
MCU_A5: MatrixDriver (Q29.1 R35.2), MCU (U1.90)
MCU_A6: MatrixDriver (Q30.1 R36.2), MCU (U1.91)
MCU_A7: MatrixDriver (Q31.1 R40.2), MCU (U1.92)
MCU_A8: MatrixDriver (Q32.1 R41.2), MCU (U1.93)
MCU_A9: MatrixDriver (Q33.1 R42.2), MCU (U1.95)
MCU_A10: MatrixDriver (Q34.1 R46.2), MCU (U1.96)
MCU_A11: MatrixDriver (Q35.1 R47.2), MCU (U1.46)
MCU_A12: MatrixDriver (Q36.1 R48.2), MCU (U1.47)
MCU_A13: MatrixDriver (Q37.1 R52.2), MCU (U1.51)
MCU_A14: MatrixDriver (Q38.1 R53.2), MCU (U1.52)
MCU_A15: MatrixDriver (Q39.1 R54.2), MCU (U1.53)
MCU_A16: MatrixDriver (Q40.1 R58.2), MCU (U1.54)
MCU_A17: MatrixDriver (Q41.1 R59.2), MCU (U1.81)
MCU_A18: MatrixDriver (Q42.1 R60.2), MCU (U1.82)
MCU_A19: MatrixDriver (Q43.1 R64.2), MCU (U1.83)
MCU_A20: MatrixDriver (Q44.1 R65.2), MCU (U1.84)
MCU_A21: MatrixDriver (Q45.1 R66.2), MCU (U1.85)
MCU_A22: MatrixDriver (Q46.1 R70.2), MCU (U1.86)
MCU_A23: MatrixDriver (Q47.1 R71.2), MCU (U1.87)
MCU_A24: MatrixDriver (Q48.1 R72.2), MCU (U1.88)
MCU_A25: MatrixDriver (Q49.1 R75.2), MCU (U1.55)
MCU_A26: MatrixDriver (Q50.1 R76.2), MCU (U1.56)
MCU_K1: MatrixDriver (Q1.1 R1.2), MCU (U1.15)
MCU_K2: MatrixDriver (Q2.1 R2.2), MCU (U1.16)
MCU_K3: MatrixDriver (Q3.1 R3.2), MCU (U1.17)
MCU_K4: MatrixDriver (Q4.1 R4.2), MCU (U1.18)
MCU_K5: MatrixDriver (Q5.1 R5.2), MCU (U1.32)
MCU_K6: MatrixDriver (Q6.1 R6.2), MCU (U1.33)
MCU_K7: MatrixDriver (Q7.1 R7.2), MCU (U1.63)
MCU_K8: MatrixDriver (Q8.1 R8.2), MCU (U1.64)
MCU_K9: MatrixDriver (Q9.1 R9.2), MCU (U1.65)
MCU_K10: MatrixDriver (Q10.1 R10.2), MCU (U1.66)
MCU_K11: MatrixDriver (Q11.1 R11.2), MCU (U1.78)
MCU_K12: MatrixDriver (Q12.1 R12.2), MCU (U1.79)
MCU_K13: MatrixDriver (Q13.1 R13.2), MCU (U1.80)
MCU_K14: MatrixDriver (Q14.1 R14.2), MCU (U1.7)
MCU_K15: MatrixDriver (Q15.1 R15.2), MCU (U1.8)
MCU_K16: MatrixDriver (Q16.1 R16.2), MCU (U1.9)
MCU_K17: MatrixDriver (Q17.1 R17.2), MCU (U1.97)
MCU_K18: MatrixDriver (Q18.1 R18.2), MCU (U1.98)
MCU_K19: MatrixDriver (Q19.1 R19.2), MCU (U1.1)
MCU_K20: MatrixDriver (Q20.1 R20.2), MCU (U1.2)
MCU_K21: MatrixDriver (Q21.1 R21.2), MCU (U1.3)
MCU_K22: MatrixDriver (Q22.1 R22.2), MCU (U1.4)
MCU_K23: MatrixDriver (Q23.1 R23.2), MCU (U1.5)
MCU_K24: MatrixDriver (Q24.1 R24.2), MCU (U1.37)
MCU_MATRIX_EN: MatrixDriver (D32.4 R112.2), MCU (U1.57)